# EAGLE design thesis (EAGLE 6.4)
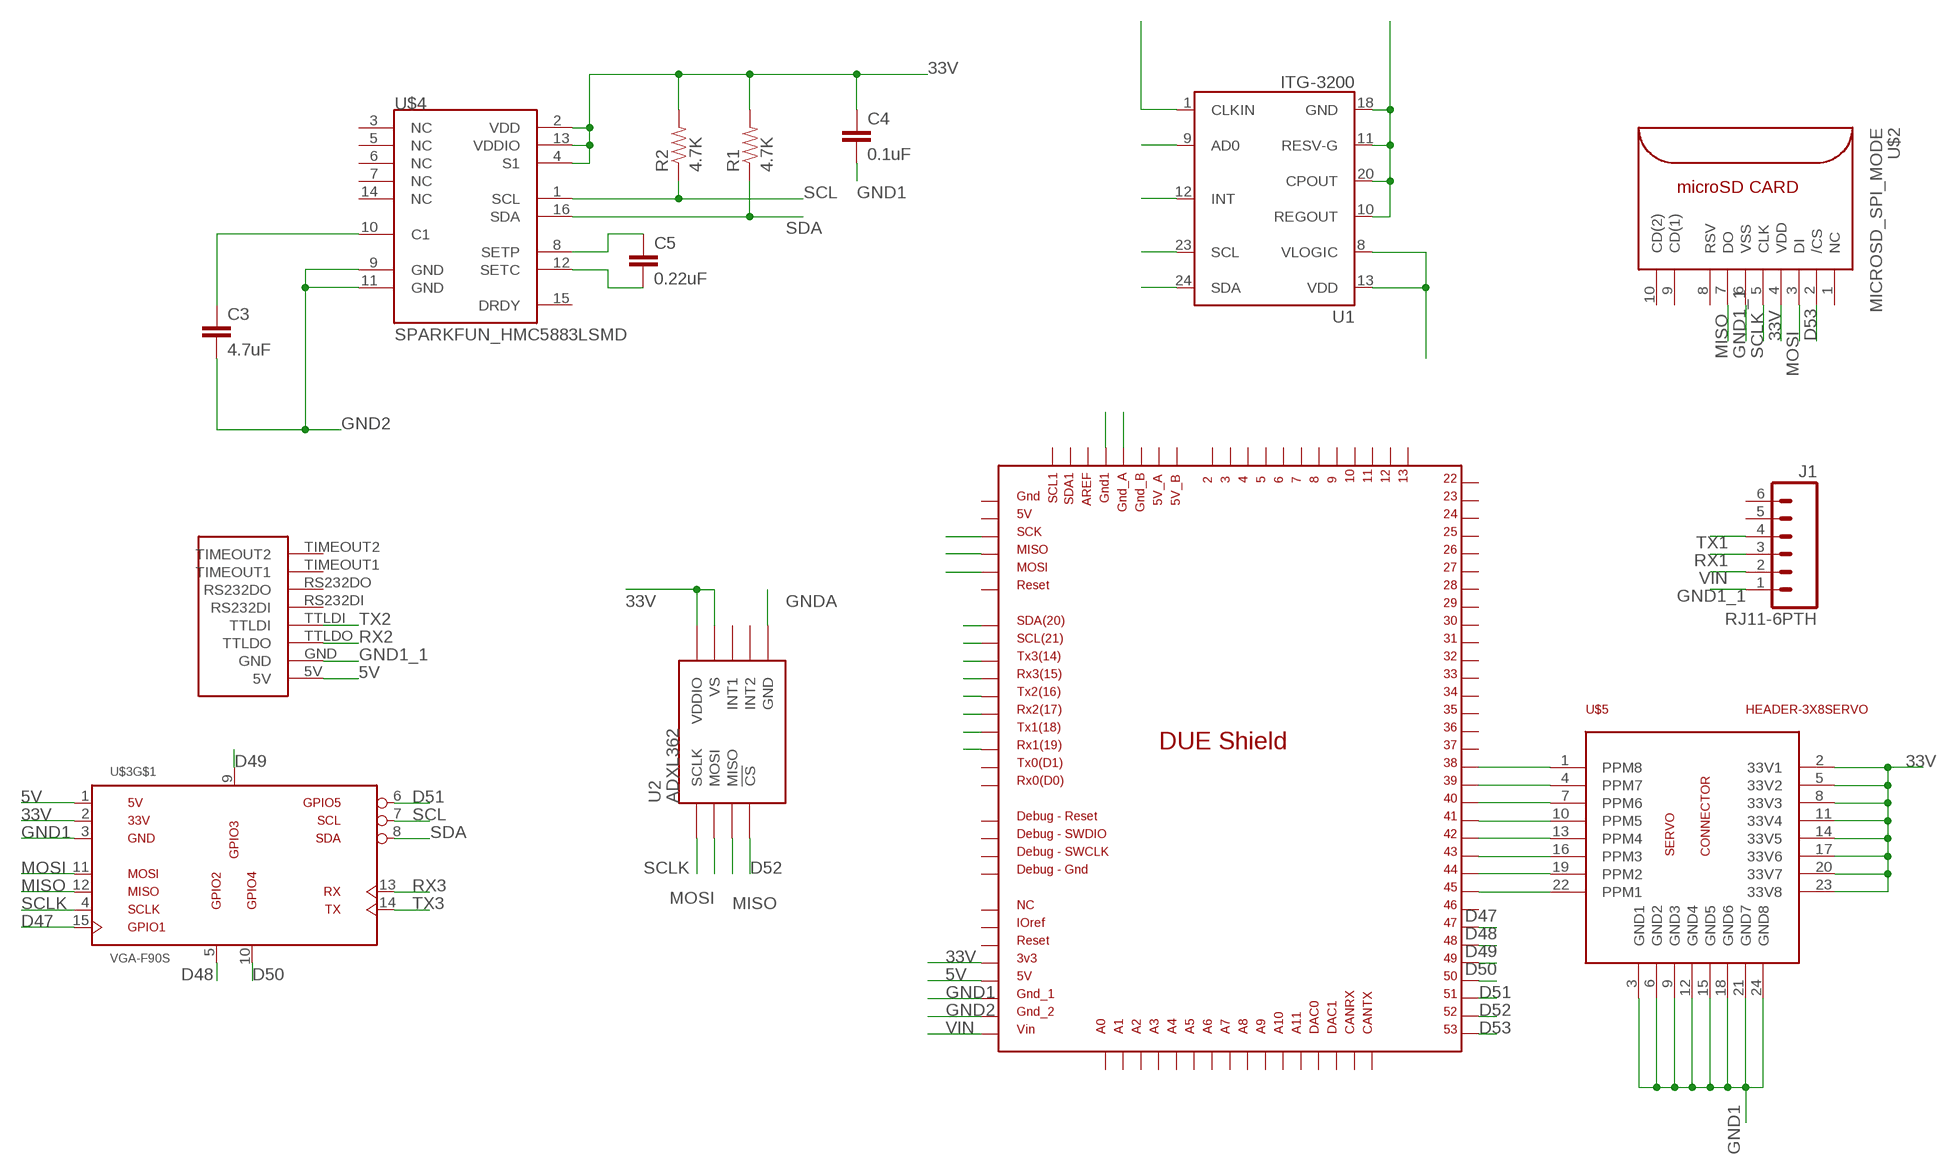
[diagram p0: schematic, sheet 1]

## Parts
C3  4.7uF  SPARKFUN_CAP0402-CAP  [SPARKFUN_0402-CAP]
C4  0.1uF  SPARKFUN_CAP0402-CAP  [SPARKFUN_0402-CAP]
C5  0.22uF  SPARKFUN_CAP0402-CAP  [SPARKFUN_0402-CAP]
J1  RJ11-6PTH  [RJ11-6]
R1  4.7K  SPARKFUN_RESISTOR0402-RES  [SPARKFUN_0402-RES]
R2  4.7K  SPARKFUN_RESISTOR0402-RES  [SPARKFUN_0402-RES]
U1  ITG-3200  [QFN-24]
U2  ADXL362  [ADXL362]
U$1  DUE(NORMAL)  [DUE(NORMAL)]
U$2  MICROSD_SPI_MODE  [MICRO_SD_CONNECTOR]
U$3  VGA-F90S  [DB-15-F90+SHIELD-SMALL_PADS]
U$4  SPARKFUN_HMC5883LSMD  [SPARKFUN_16LPCC]
U$5  HEADER-3X8SERVO  [3X8RA]
U$6  UBLOXLEA6TBOB  [UBLOXLEA6TBOB]

## Nets
5V: U$1.5V U$3.1(VGA-R) U$6.5V
33V: C4.1 R1.2 R2.2 U1.8(VLOGIC) U1.9(AD0) U1.13(VDD) U2.P$1(VDDIO) U2.P$14(VS) U$1.3V3 U$2.4(VDD) U$3.2(VGA-G) U$4.2(VDD) U$4.4(S1) U$4.13(VDDIO) U$5.2(33V1) U$5.5(33V2) U$5.8(33V3) U$5.11(33V4) U$5.14(33V5) U$5.17(33V6) U$5.20(33V7) U$5.23(33V8)
D47: U$1.47 U$3.15(ID3/SCL)
D48: U$1.48 U$3.5(GND)
D49: U$1.49 U$3.9(+5V)
D50: U$1.50 U$3.10(GND)
D51: U$1.51 U$3.6(VGA-R-)
D52: U2.P$8(!CS) U$1.52
D53: U$1.53 U$2.2(/CS)
GND1: C4.2 U$1.GND_1 U$3.3(VGA-B) U$5.3(GND1) U$5.6(GND2) U$5.9(GND3) U$5.12(GND4) U$5.15(GND5) U$5.18(GND6) U$5.21(GND7) U$5.24(GND8)
GND1_1: J1.1 U$1.GND1 U$2.6(VSS) U$6.GND
GND2: C3.2 U$1.GND_2 U$4.9(GND) U$4.11(GND)
GNDA: U1.1(CLKIN) U1.10(REGOUT) U1.11(RESV-G) U1.12(INT) U1.18(GND) U1.20(CPOUT) U2.P$12(GND) U2.P$13(GND) U2.P$16(GND) U$1.GND_A
MISO: U2.P$7(MISO) U$1.MISO_ICSP U$2.7(DO) U$3.12(ID1/SDA)
MOSI: U2.P$6(MOSI) U$1.MOSI_ICSP U$2.3(DI) U$3.11(ID0/RES)
N$1: U$1.38 U$5.1(PPM8)
N$2: U$1.39 U$5.4(PPM7)
N$3: U$1.40 U$5.7(PPM6)
N$4: U$1.41 U$5.10(PPM5)
N$5: C5.1 U$4.8(SETP)
N$6: U$1.42 U$5.13(PPM4)
N$7: C5.2 U$4.12(SETC)
N$8: U$1.43 U$5.16(PPM3)
N$9: U$1.44 U$5.19(PPM2)
N$10: U$1.45 U$5.22(PPM1)
N$12: C3.1 U$4.10(C1)
RX1: J1.3 U$1.RX1
RX2: U$1.RX2 U$6.TTLDO
RX3: U$1.RX3 U$3.13(VGA-HSYNC)
SCL: R2.1 U1.23(SCL) U$1.SCL U$3.7(VGA-G-) U$4.1(SCL)
SCLK: U2.P$4(SCLK) U$1.SCK_ICSP U$2.5(CLK) U$3.4(ID2/RES)
SDA: R1.1 U1.24(SDA) U$1.SDA U$3.8(VGA-B-) U$4.16(SDA)
TX1: J1.4 U$1.TX1
TX2: U$1.TX2 U$6.TTLDI
TX3: U$1.TX3 U$3.14(VGA-VSYNC)
VIN: J1.2 U$1.VIN
Unconnected: J1.5 J1.6 U2.P$9(INT2) U2.P$11(INT1) U$1.2 U$1.3 U$1.4 U$1.5 U$1.5V_A U$1.5V_B U$1.5V_ICSP U$1.6 U$1.7 U$1.8 U$1.9 U$1.10 U$1.11 U$1.12 U$1.13 U$1.22 U$1.23 U$1.24 U$1.25 U$1.26 U$1.27 U$1.28 U$1.29 U$1.30 U$1.31 U$1.32 U$1.33 U$1.34 U$1.35 U$1.36 U$1.37 U$1.46 U$1.A0 U$1.A1 U$1.A2 U$1.A3 U$1.A4 U$1.A5 U$1.A6 U$1.A7 U$1.A8 U$1.A9 U$1.A10 U$1.A11 U$1.AREF U$1.CANRX U$1.CANTX U$1.DAC0 U$1.DAC1 U$1.GND_B U$1.GND_DEBUG U$1.GND_ICSP U$1.IOREF U$1.NC U$1.RESET U$1.RESET_DEBUG U$1.RESET_ICSP U$1.RX0 U$1.SCL1 U$1.SDA1 U$1.SWCLK_DEBUG U$1.SWDIO_DEBUG U$1.TX0 U$2.1(NC) U$2.8(RSV) U$2.9(CD(1)) U$2.10(CD(2)) U$3.SHIELD@1(SHIELD) U$3.SHIELD@2(SHIELD) U$4.3(NC) U$4.5(NC) U$4.6(NC) U$4.7(NC) U$4.14(NC) U$4.15(DRDY) U$6.RS232DI U$6.RS232DO U$6.TIMEOUT1 U$6.TIMEOUT2

## Library data of the parts
C3-C5 = HMC5883L_Breakout-v11:SPARKFUN_CAP: Capacitor Standard 0603 ceramic capacitor, and 0.1" leaded capacitor.
J1 = SparkFun-Connectors:RJ11-6: RJ11 Jack Simple 6 pin RJ11 jack. Commonly found on CAT3 devices and Microchip programmers. SKU: PRT-00132
R1 R2 = HMC5883L_Breakout-v11:SPARKFUN_RESISTOR: Resistor Basic schematic elements and footprints for 0603, 1206, and PTH resistors.
U1 = SparkFun:ITG-3200: ITG-3200 3-axis gyro, digital output, qfn24 package
U2 = SparkFun-Sensors:ADXL362: Micropower 3-axis accelerometer 2/4/8g digital output (SPI) IC-11297; PROD_ID: IC-11297
U$1 = DUElib130425:DUE(NORMAL)
U$2 = con-molex-microsd:MICROSD_SPI_MODE: MOLEX - 49225-0821 - CONNECTEUR MICRO SD PUSH/PUSH REV Fabricant: MOLEX Code commande Farnell: 1366700 <http://fr.farnell.com/molex/49225-0821/connecteur-micro-sd-push-push-rev/dp/1366700?Ntt=1366700> Référence fabricant: 49225-0821
U$3 = VideoConnectors:VGA-*
U$4 = HMC5883L_Breakout-v11:SPARKFUN_HMC5883L: 3 Axis Digital Compass IC
U$5 = pixhawk2:HEADER-3X8
U$6 = csgshop:UBLOXLEA6TBOB

## Board
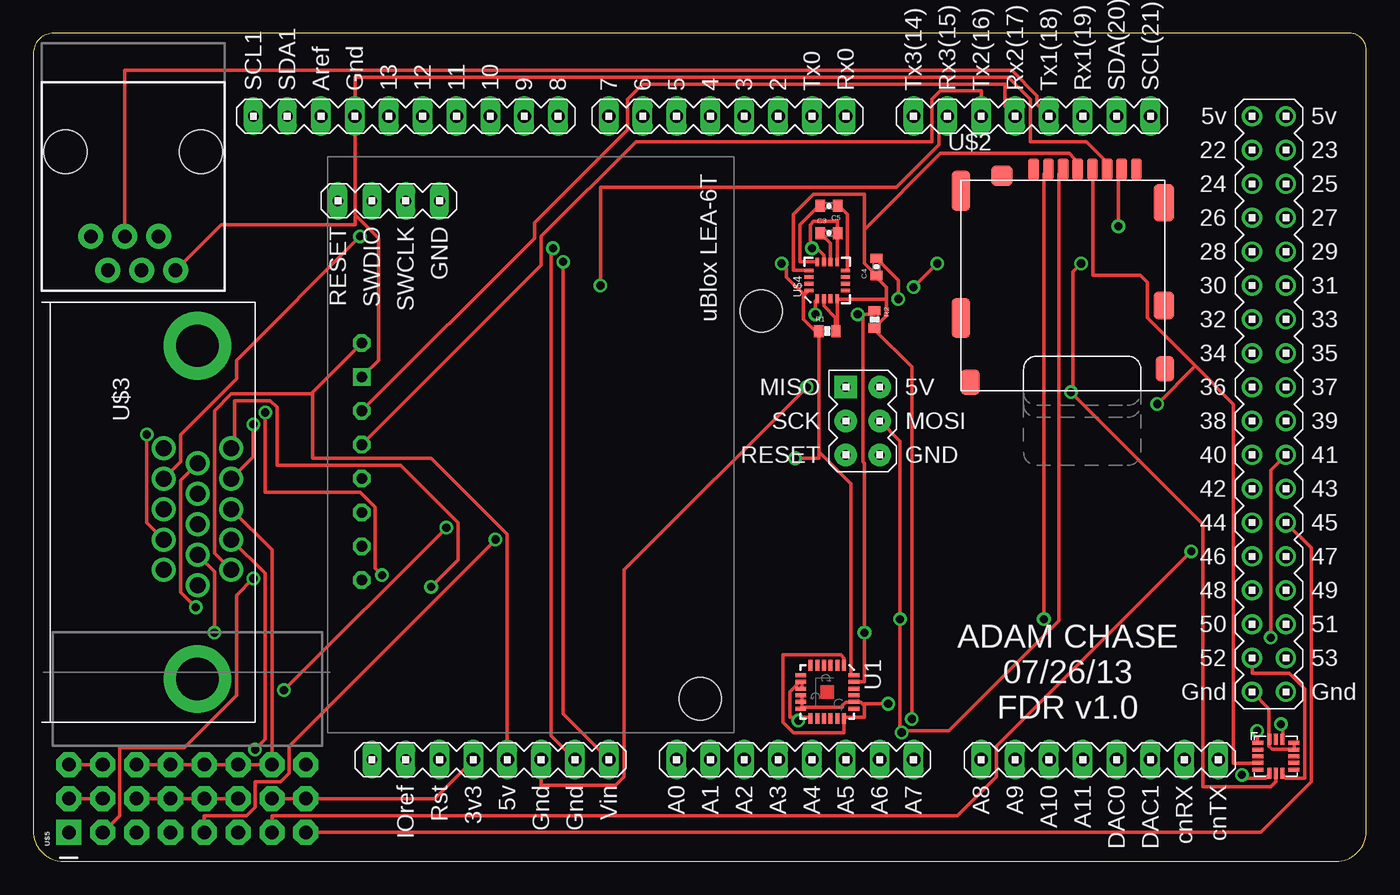
[diagram p1: board, top side]
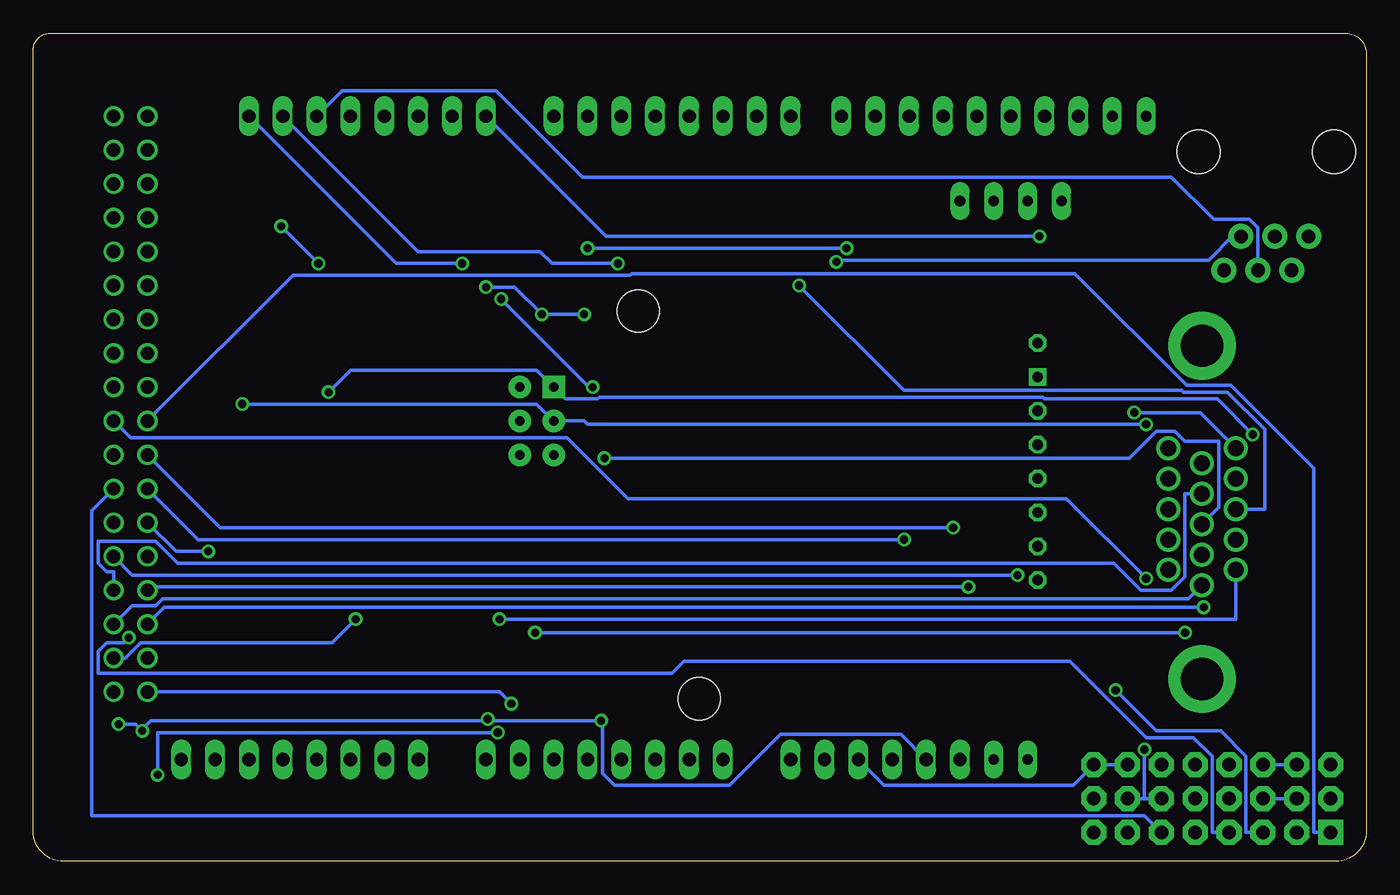
[diagram p2: board, bottom side, seen from below]

Size 100 x 62.09 mm. Coordinates in mm from the lower left corner, seen from the top.
Outline: 100,2.25 100,60.87 arc90 98.78,62.09 1.52,62.09 arc90 0,60.57 0,2.26 arc90 2.26,0 97.75,0 arc90 100,2.25
Copper layers (1*16): Top 0.035mm / dielectric 1.5mm / Bottom 0.035mm
Design rules "default": minimum track width 10mil, minimum drill 24mil, track to track 8mil, track to pad 8mil, pad to pad 8mil, via to via 8mil, smd to smd 8mil, copper to edge 40mil, drill to drill 8mil, minimum pad ring 10mil, minimum via ring 8mil, stop-mask expansion 4mil, vias tented up to drill 0mil, thermal gap 10mil
Holes 3.17 mm at 54.61,41.27

### Footprints (pad centres in the part's own frame; a part is rotated, then mirrored left to right if it is on the bottom)
SPARKFUN_0402-CAP = smd 0.7 x 0.9: 1 -0.65,0; 2 0.65,0
RJ11-6 = drill 1.016 pad 1.88: 1 1.905,8.89; 2 3.175,6.35; 3 4.445,8.89; 4 5.715,6.35; 5 6.985,8.89; 6 8.255,6.35 | hole 3.251: 0,0; 10.16,0
SPARKFUN_0402-RES = smd 0.7 x 0.9: 1 -0.65,0; 2 0.65,0
QFN-24 = smd 0.8 x 0.3: 1 -2,1.25; 2 -2,0.75; 3 -2,0.25; 4 -2,-0.25; 5 -2,-0.75; 6 -2,-1.25; 13 2,-1.25; 14 2,-0.75; 15 2,-0.25; 16 2,0.25; 17 2,0.75; 18 2,1.25 | smd 0.3 x 0.8: 7 -1.25,-2; 8 -0.75,-2; 9 -0.25,-2; 10 0.25,-2; 11 0.75,-2; 12 1.25,-2; 19 1.25,2; 20 0.75,2; 21 0.25,2; 22 -0.25,2; 23 -0.75,2; 24 -1.25,2
ADXL362 = smd 0.8 x 0.3: P$1 -1.35,1; P$2 -1.35,0.5; P$3 -1.35,0; P$4 -1.35,-0.5; P$5 -1.35,-1; P$9 1.35,-1; P$10 1.35,-0.5; P$11 1.35,0; P$12 1.35,0.5; P$13 1.35,1 | smd 0.3 x 0.8: P$6 -0.5,-1.275; P$7 0,-1.275; P$8 0.5,-1.275; P$14 0.5,1.275; P$15 0,1.275; P$16 -0.5,1.275
DUE(NORMAL) = drill 1 long: 2 -16.51,30.48; 3 -19.05,30.48; 3V3 -39.37,-17.78; 4 -21.59,30.48; 5 -24.13,30.48; 5V -36.83,-17.78; 6 -26.67,30.48; 7 -29.21,30.48; 8 -33.02,30.48; 9 -35.56,30.48; 10 -38.1,30.48; 11 -40.64,30.48; 12 -43.18,30.48; 13 -45.72,30.48; A0 -24.13,-17.78; A1 -21.59,-17.78; A2 -19.05,-17.78; A3 -16.51,-17.78; A4 -13.97,-17.78; A5 -11.43,-17.78; A6 -8.89,-17.78; A7 -6.35,-17.78; A8 -1.27,-17.78; A9 1.27,-17.78; A10 3.81,-17.78; A11 6.35,-17.78; AREF -50.8,30.48; AREF1 -50.8,30.48; CANRX 13.97,-17.78; CANTX 16.51,-17.78; DAC0 8.89,-17.78; DAC1 11.43,-17.78; GND1 -48.26,30.48; GND_1 -34.29,-17.78; GND_2 -31.75,-17.78; RESET -41.91,-17.78; RX0 -11.43,30.48; RX1 6.35,30.48; RX2 1.27,30.48; RX3 -3.81,30.48; SCL 11.43,30.48; SDA 8.89,30.48; TX0 -13.97,30.48; TX1 3.81,30.48; TX2 -1.27,30.48; TX3 -6.35,30.48; VIN -29.21,-17.78 | drill 1: 5V_A 19.05,30.48; 5V_B 21.59,30.48; 22 19.05,27.94; 23 21.59,27.94; 24 19.05,25.4; 25 21.59,25.4; 26 19.05,22.86; 27 21.59,22.86; 28 19.05,20.32; 29 21.59,20.32; 30 19.05,17.78; 31 21.59,17.78; 32 19.05,15.24; 33 21.59,15.24; 34 19.05,12.7; 35 21.59,12.7; 36 19.05,10.16; 37 21.59,10.16; 38 19.05,7.62; 39 21.59,7.62; 40 19.05,5.08; 41 21.59,5.08; 42 19.05,2.54; 43 21.59,2.54; 44 19.05,0; 45 21.59,0; 46 19.05,-2.54; 47 21.59,-2.54; 48 19.05,-5.08; 49 21.59,-5.08; 50 19.05,-7.62; 51 21.59,-7.62; 52 19.05,-10.16; 53 21.59,-10.16; GND_A 19.05,-12.7; GND_B 21.59,-12.7 | drill 0.7 pad 1.676: 5V_ICSP -8.89,5.08; GND_ICSP -8.89,10.16; MOSI_ICSP -8.89,7.62; RESET_ICSP -11.43,5.08; SCK_ICSP -11.43,7.62 | drill 0.8 pad 1.422 long: GND_DEBUG -41.91,24.13; IOREF -44.45,-17.78; NC -46.99,-17.78; RESET_DEBUG -49.53,24.13; SCL1 -55.88,30.48; SDA1 -53.34,30.48; SWCLK_DEBUG -44.45,24.13; SWDIO_DEBUG -46.99,24.13 | drill 0.7 pad 1.676 square: MISO_ICSP -11.43,10.16
MICRO_SD_CONNECTOR = smd 0.8 x 1.6: 1 -2.03,8.2; 2 -0.93,8.2; 3 0.17,8.2; 4 1.27,8.2; 5 2.37,8.2; 6 3.47,8.2; 7 4.57,8.2; 8 5.67,8.2 | smd 1.55 x 2.8: 9 7.735,5.7 | smd 1.55 x 2.1: 10 7.735,-2 | smd 1.4 x 1.9: 11 7.81,-6.75; 12 -6.79,-7.75 | smd 1.4 x 3: 13 -7.49,-2.95; 14 -7.49,6.6 | smd 1.6 x 1.55: 15 -4.43,7.725
DB-15-F90+SHIELD-SMALL_PADS = drill 1.2 pad 1.524: 1 4.318,14.224; 2 2.032,14.224; 3 -0.254,14.224; 4 -2.54,14.224; 5 -4.826,14.224; 6 5.461,11.684; 7 3.175,11.684; 8 0.889,11.684; 9 -1.397,11.684; 10 -3.683,11.684; 11 4.318,9.144; 12 2.032,9.144; 13 -0.254,9.144; 14 -2.54,9.144; 15 -4.826,9.144 | drill 3.175 pad 5.08: SHIELD@1 -12.497,11.684; SHIELD@2 12.497,11.684
SPARKFUN_16LPCC = smd 0.65 x 0.28: 1 -1.37,0.75; 2 -1.37,0.25; 3 -1.37,-0.25; 4 -1.37,-0.75; 9 1.37,-0.75; 10 1.37,-0.25; 11 1.37,0.25; 12 1.37,0.75 | smd 0.28 x 0.65: 5 -0.75,-1.37; 6 -0.25,-1.37; 7 0.25,-1.37; 8 0.75,-1.37; 13 0.75,1.37; 14 0.25,1.37; 15 -0.25,1.37; 16 -0.75,1.37
3X8RA = drill 1.016 pad 1.88 square: 1 -1.27,8.89 | drill 1.016 pad 1.88 octagon: 2 1.27,8.89; 3 3.81,8.89; 4 -1.27,6.35; 5 1.27,6.35; 6 3.81,6.35; 7 -1.27,3.81; 8 1.27,3.81; 9 3.81,3.81; 10 -1.27,1.27; 11 1.27,1.27; 12 3.81,1.27; 13 -1.27,-1.27; 14 1.27,-1.27; 15 3.81,-1.27; 16 -1.27,-3.81; 17 1.27,-3.81; 18 3.81,-3.81; 19 -1.27,-6.35; 20 1.27,-6.35; 21 3.81,-6.35; 22 -1.27,-8.89; 23 1.27,-8.89; 24 3.81,-8.89
UBLOXLEA6TBOB = drill 0.8 octagon: 5V 13.97,2.54; RS232DI 24.13,2.54; RS232DO 26.67,2.54; TIMEOUT1 29.21,2.54; TIMEOUT2 31.75,2.54; TTLDI 21.59,2.54; TTLDO 19.05,2.54 | drill 0.8 square: GND 16.51,2.54 | hole 3.175: 40.64,27.94

### Placement (x,y rotation side)
C3  59.69,47.12 0 top
C4  63.25,44.58 90 top
C5  59.69,49.15 180 top
J1  12.57,53.21 180 top
R1  59.56,39.75 0 top
R2  63.12,40.64 270 top
U1  59.56,12.7 270 top
U2  93.22,7.87 0 top
U$1  72.39,25.4 0 top
U$2  77.09,43.69 0 top
U$3  0.64,26.16 270 top
U$4  59.56,43.56 90 top
U$5  11.56,3.43 90 top
U$6  22.1,52.83 270 top

### Tracks (layer width: path | path; a pad name or v marks a point on that pad's centre or on a via)
5V
  Top 0.254: 20.89,35.12 20.83,35.05 14.86,35.05 13.59,33.78 13.59,23.11 U$3.1 | 20.89,35.12 U$6.5V | U$1.5V 35.56,24.51 29.84,30.23 20.95,30.23 20.95,35.05 20.89,35.12
33V  (via drill 0.61)
  Top 0.254: U$1.3V3 30.1,4.7 U$5.23 U$5.20 | U$5.5 U$5.2 | U$5.8 U$5.11 U$5.14 U$5.17 | U$3.2 17.4,21.59 17.4,9.14 v16.64,8.38 | U$4.2 59.31,42.16 59.31,41.66 60.2,40.77 60.2,39.75 R1.2 60.33,39.75 60.33,42.16 U$4.4 60.45,42.16 64.01,42.16 | 62.36,47.37 62.36,44.83 63.25,43.94 C4.1 63.25,43.81 64.01,43.05 64.01,42.16 | 62.36,47.37 62.36,50.04 58.55,50.04 57.02,48.51 57.02,44.32 58.17,44.32 U$4.13 | 64.01,42.16 64.01,40.89 63.12,40.01 R2.2 63.12,39.88 65.91,37.08 v65.91,10.67 | 62.36,47.37 68.07,53.09 77.72,53.09 78.11,52.7 78.11,52.2 78.36,51.94 U$2.4 | v91.82,9.78 91.82,8.89 U2.P$1 | v93.6,10.29 93.73,10.16 93.73,9.27 U2.P$14 | U1.9 57.66,12.95 57.66,13.34 U1.8 57.53,13.46 56.77,12.7 56.77,10.79 57.4,10.79 | 57.4,10.79 58.29,10.79 U1.13 | 57.4,10.79 v57.4,10.54
  Bottom 0.254: U$5.8 U$5.5 | 16.64,4.7 v16.64,8.38 | U$5.17 16.64,4.7 | 16.64,4.7 U$5.20 | v93.6,10.29 92.33,10.29 v91.82,9.78 91.82,9.91 91.19,10.54 65.91,10.54 | 65.91,10.54 v57.4,10.54 57.28,10.54 57.28,6.6 56.39,5.71 47.75,5.71 43.94,9.53 34.92,9.53 U$1.3V3 | 65.91,10.54 v65.91,10.67
D47  (via drill 0.61)
  Top 0.254: v26.16,21.46 25.65,21.97 25.65,26.54 24.51,27.69 17.4,27.69 v17.4,33.66
  Bottom 0.254: U$1.47 92.58,21.46 v26.16,21.46 | v17.4,33.66 12.45,33.66 U$3.15
D48  (via drill 0.61)
  Top 0.254: v29.84,20.57 31.88,22.61 31.88,25.4 27.56,29.72 18.29,29.72 18.29,34.04 17.78,34.54 15.11,34.54 15.11,31.24 U$3.5
  Bottom 0.254: U$1.48 91.19,20.57 v29.84,20.57
D49
  Bottom 0.254: U$1.49 93.98,21.72 94.49,21.72 95.12,22.35 95.12,24 90.81,24 89.15,22.35 18.92,22.35 16.89,20.32 14.61,20.32 13.59,21.34 13.59,27.56 U$3.9
D50  (via drill 0.61)
  Top 0.254: v12.19,19.05 11.05,20.19 11.05,28.57 U$3.10
  Bottom 0.254: U$1.50 90.17,19.05 v12.19,19.05
D51
  Bottom 0.254: U$1.51 92.58,19.18 90.81,19.18 90.3,19.68 13.34,19.68 U$3.6
D52
  Top 0.254: U$1.52 91.44,14.1 94.23,14.1 95.38,12.95 95.38,6.22 93.98,6.22 93.73,6.48 U2.P$8
D53  (via drill 0.61)
  Top 0.254: v75.82,18.16 75.82,51.56 76.07,51.82 U$2.2
  Bottom 0.254: v75.82,18.16 77.6,16.38 91.95,16.38 93.09,15.24 U$1.53
GND1  (via drill 0.61)
  Top 0.254: U$5.6 U$5.3 | U$5.9 U$5.12 U$5.15 U$5.18 U$5.21 17.91,23.37 U$3.3 | v64.9,42.16 64.9,43.56 63.25,45.21 C4.2 | v58.04,35.56 44.32,21.84 44.32,6.35 43.69,5.71 38.1,5.71 U$1.GND_1
  Bottom 0.254: U$5.9 U$5.6 | U$5.21 U$5.24 21.97,5.71 36.2,5.71 U$1.GND_1 | v64.9,42.16 58.29,35.56 v58.04,35.56
GND1_1
  Top 0.254: U$2.6 80.52,51.94 80.26,52.2 80.26,52.7 78.99,53.98 74.8,53.98 74.8,57.15 73.15,58.8 24.13,58.8 U$1.GND1 24.13,48.51 24.19,48.45 | U$6.GND 25.91,37.59 25.91,46.74 24.19,48.45 | J1.1 14.1,47.75 24.13,47.75 24.13,48.39 24.19,48.45
GND2  (via drill 0.61)
  Top 0.254: 58.61,46.16 58.29,46.48 58.29,47.75 58.55,48.01 60.33,48.01 60.33,47.12 | 58.61,46.16 59.31,45.47 59.31,44.96 U$4.11 | 60.33,47.12 60.33,44.96 U$4.9 | 60.33,47.12 C3.2 | v58.42,45.97 58.61,46.16 | v38.99,45.97 38.86,45.85 38.86,9.4 U$1.GND_2
  Bottom 0.254: v38.99,45.97 v58.42,45.97
GNDA  (via drill 0.61)
  Top 0.254: U1.10 57.66,12.45 57.66,12.06 U1.11 57.66,11.94 57.66,11.56 U1.12 57.78,11.56 60.71,11.56 60.71,11.68 60.96,11.94 61.47,11.94 U1.20 61.59,11.94 62.1,11.94 62.29,11.75 | 62.29,11.75 62.36,11.68 62.36,10.79 60.83,10.79 U1.18 60.83,10.67 60.83,9.65 57.02,9.65 56.26,10.41 56.26,15.49 60.58,15.49 60.83,15.24 60.83,14.73 U1.1 | U2.P$13 94.61,8.76 94.61,8.38 U2.P$12 94.49,8.38 92.96,8.38 92.71,8.64 U2.P$16 92.71,9.27 92.71,11.43 U$1.GND_A | v64.14,11.81 62.36,11.81 62.29,11.75
  Bottom 0.254: v64.14,11.81 65.02,12.7 U$1.GND_A
MISO  (via drill 0.61)
  Top 0.254: U2.P$7 93.22,5.97 92.84,5.59 87.76,5.59 87.76,25.27 v77.85,35.18 77.98,35.18 77.98,44.2 v78.61,44.83 | v81.41,47.62 81.41,51.69 81.53,51.82 U$2.7 | U$3.12 8.51,25.4 v8.51,32
  Bottom 0.254: v77.85,35.18 76.2,36.83 62.23,36.83 U$1.MISO_ICSP 60.07,34.67 57.66,34.67 57.53,34.8 24.26,34.8 24.13,34.67 11.18,34.67 v8.51,32 | v78.61,44.83 v81.41,47.62
MOSI  (via drill 0.61)
  Top 0.254: v90.68,6.48 90.68,6.22 92.46,6.22 92.71,6.48 U2.P$6 | U$1.MOSI_ICSP 65.02,31.5 v65.02,18.16 65.02,9.78 v65.15,9.65 65.15,9.78 68.71,9.78 76.96,18.03 76.96,51.56 77.22,51.82 U$2.3
  Bottom 0.254: v90.68,6.48 90.68,9.65 v65.15,9.65 | U$3.11 9.78,18.16 v65.02,18.16
N$1
  Bottom 0.254: U$1.38 80.52,43.94 55.24,43.94 55.12,44.07 21.84,44.07 13.46,35.69 10.16,35.69 3.94,29.46 3.94,2.16 U$5.1
N$2  (via drill 0.61)
  Top 0.254: v16.51,21.21 15.24,19.94 15.24,12.45 11.3,8.51 6.48,8.51 6.48,3.43 U$5.4
  Bottom 0.254: U$1.39 92.71,31.75 59.94,31.75 55.37,27.18 22.48,27.18 v16.51,21.21
N$3  (via drill 0.61)
  Top 0.254: v18.8,12.83 v30.99,25.02
  Bottom 0.254: U$1.40 85.98,25.02 v30.99,25.02 | v18.8,12.83 15.75,9.78 10.92,9.78 9.02,7.87 9.02,2.16 U$5.7
N$4  (via drill 0.61)
  Top 0.254: U$1.41 92.84,29.34 v92.84,16.76
  Bottom 0.254: v92.84,16.76 93.22,16.38 94.49,16.38 95.12,15.75 95.12,14.1 52.07,14.1 51.18,14.99 22.23,14.99 16.51,9.27 12.95,9.27 11.56,7.87 11.56,2.16 U$5.10
N$5
  Top 0.254: U$4.8 60.96,44.32 61.09,44.45 61.09,48.51 60.45,49.15 C5.1
N$6  (via drill 0.61)
  Top 0.254: v34.67,24.13 19.18,8.64 19.18,6.6 18.54,5.97 16.64,5.97 16.64,4.06 16,3.43 12.83,3.43 U$5.13
  Bottom 0.254: U$1.42 87.63,24.13 v34.67,24.13
N$7
  Top 0.254: U$4.12 58.8,44.96 57.53,44.96 57.53,47.75 58.93,49.15 C5.2
N$8
  Bottom 0.254: U$1.43 95.63,26.29 95.63,3.43 16.64,3.43 U$5.16
N$9  (via drill 0.61)
  Top 0.254: v86.87,23.24 72.26,8.64 72.26,6.35 69.34,3.43 17.91,3.43 U$5.19
  Bottom 0.254: U$1.44 89.28,23.24 v86.87,23.24
N$10
  Top 0.254: U$1.45 95.89,23.5 95.89,5.97 92.08,2.16 U$5.22
N$12
  Top 0.254: U$4.10 59.82,44.96 59.82,46.35 59.05,47.12 C3.1
RX1
  Bottom 0.254: U$1.RX1 76.83,57.78 65.28,57.78 58.8,51.31 14.61,51.31 11.43,48.13 8.76,48.13 8.13,47.5 J1.3
RX2
  Top 0.254: U$6.TTLDO 37.59,46.74 37.59,47.88 44.58,54.86 44.58,57.15 45.72,58.29 72.9,58.29 72.9,56.64 U$1.RX2
RX3  (via drill 0.61)
  Top 0.254: U$1.RX3 67.94,55.24 67.94,53.72 64.77,50.55 42.55,50.55 v42.55,43.18
  Bottom 0.254: v42.55,43.18 34.67,35.31 13.84,35.31 13.72,35.18 10.41,35.18 7.62,32.38 7.62,26.42 U$3.13
SCL  (via drill 0.61)
  Top 0.254: v58.67,41.02 58.67,42.04 58.8,42.16 U$4.1 | 62.23,41.02 63.12,41.02 R2.1 | 62.23,41.02 62.23,29.97 62.36,29.84 v62.36,17.14 62.36,13.46 61.59,13.46 U1.23 | 62.23,41.02 v61.85,41.02 | v66.04,43.05 v67.82,44.83 | U$3.7 13.59,21.72 v13.59,17.14
  Bottom 0.254: v58.67,41.02 v61.85,41.02 63.88,43.05 v66.04,43.05 | U$1.SCL 72.77,44.83 v67.82,44.83 | v62.36,17.14 v13.59,17.14
SCLK  (via drill 0.61)
  Top 0.254: 87.19,37.15 83.57,40.77 83.57,43.43 83.06,43.94 79.5,43.94 79.5,51.82 U$2.5 | 87.19,37.15 90.04,34.29 90.04,7.37 91.82,7.37 U2.P$4 | 87.19,37.15 v84.33,34.29 | U$3.4 16.51,30.35 v16.51,32.77
  Bottom 0.254: v84.33,34.29 62.23,34.29 U$1.SCK_ICSP 58.67,33.02 58.42,32.77 v16.51,32.77
SDA  (via drill 0.61)
  Top 0.254: 57.85,42.48 57.78,42.42 57.78,40.64 58.67,39.75 R1.1 58.93,39.75 58.93,30.73 58.99,30.67 | 57.85,42.48 58.17,42.8 U$4.16 | 58.99,30.67 61.34,28.32 61.34,14.1 61.47,13.97 U1.24 | v56.13,44.83 56.52,44.45 56.52,43.81 57.85,42.48 | v57.15,30.23 58.93,30.23 58.93,30.61 58.99,30.67
  Bottom 0.254: U$1.SDA 71.12,45.72 61.98,45.72 61.09,44.83 v56.13,44.83 | U$3.8 11.05,26.54 11.05,31.5 13.59,31.5 14.35,32.26 15.75,32.26 17.78,30.23 v57.15,30.23
TX1
  Top 0.254: U$1.TX1 75.31,56.77 75.31,57.4 73.41,59.31 6.86,59.31 J1.4
TX2
  Top 0.254: U$6.TTLDI 38.1,44.7 38.1,46.86 45.21,53.98 67.44,53.98 67.44,57.15 68.07,57.78 71.12,57.78 U$1.TX2
TX3  (via drill 0.61)
  Top 0.254: v24.51,46.86 15.24,37.59 15.24,36.2 11.05,32 11.05,29.97 U$3.14
  Bottom 0.254: U$1.TX3 57.02,46.86 v24.51,46.86
VIN  (via drill 0.61)
  Top 0.254: U$1.VIN 39.75,11.05 v39.75,44.96
  Bottom 0.254: v39.75,44.96 39.62,45.09 11.81,45.09 10.03,46.86 J1.2

### Text on the board
tPlace: ADAM CHASE / 07/26/13 / FDR v1.0